# EasyEDA schematic SCH_OpenIDS2.json
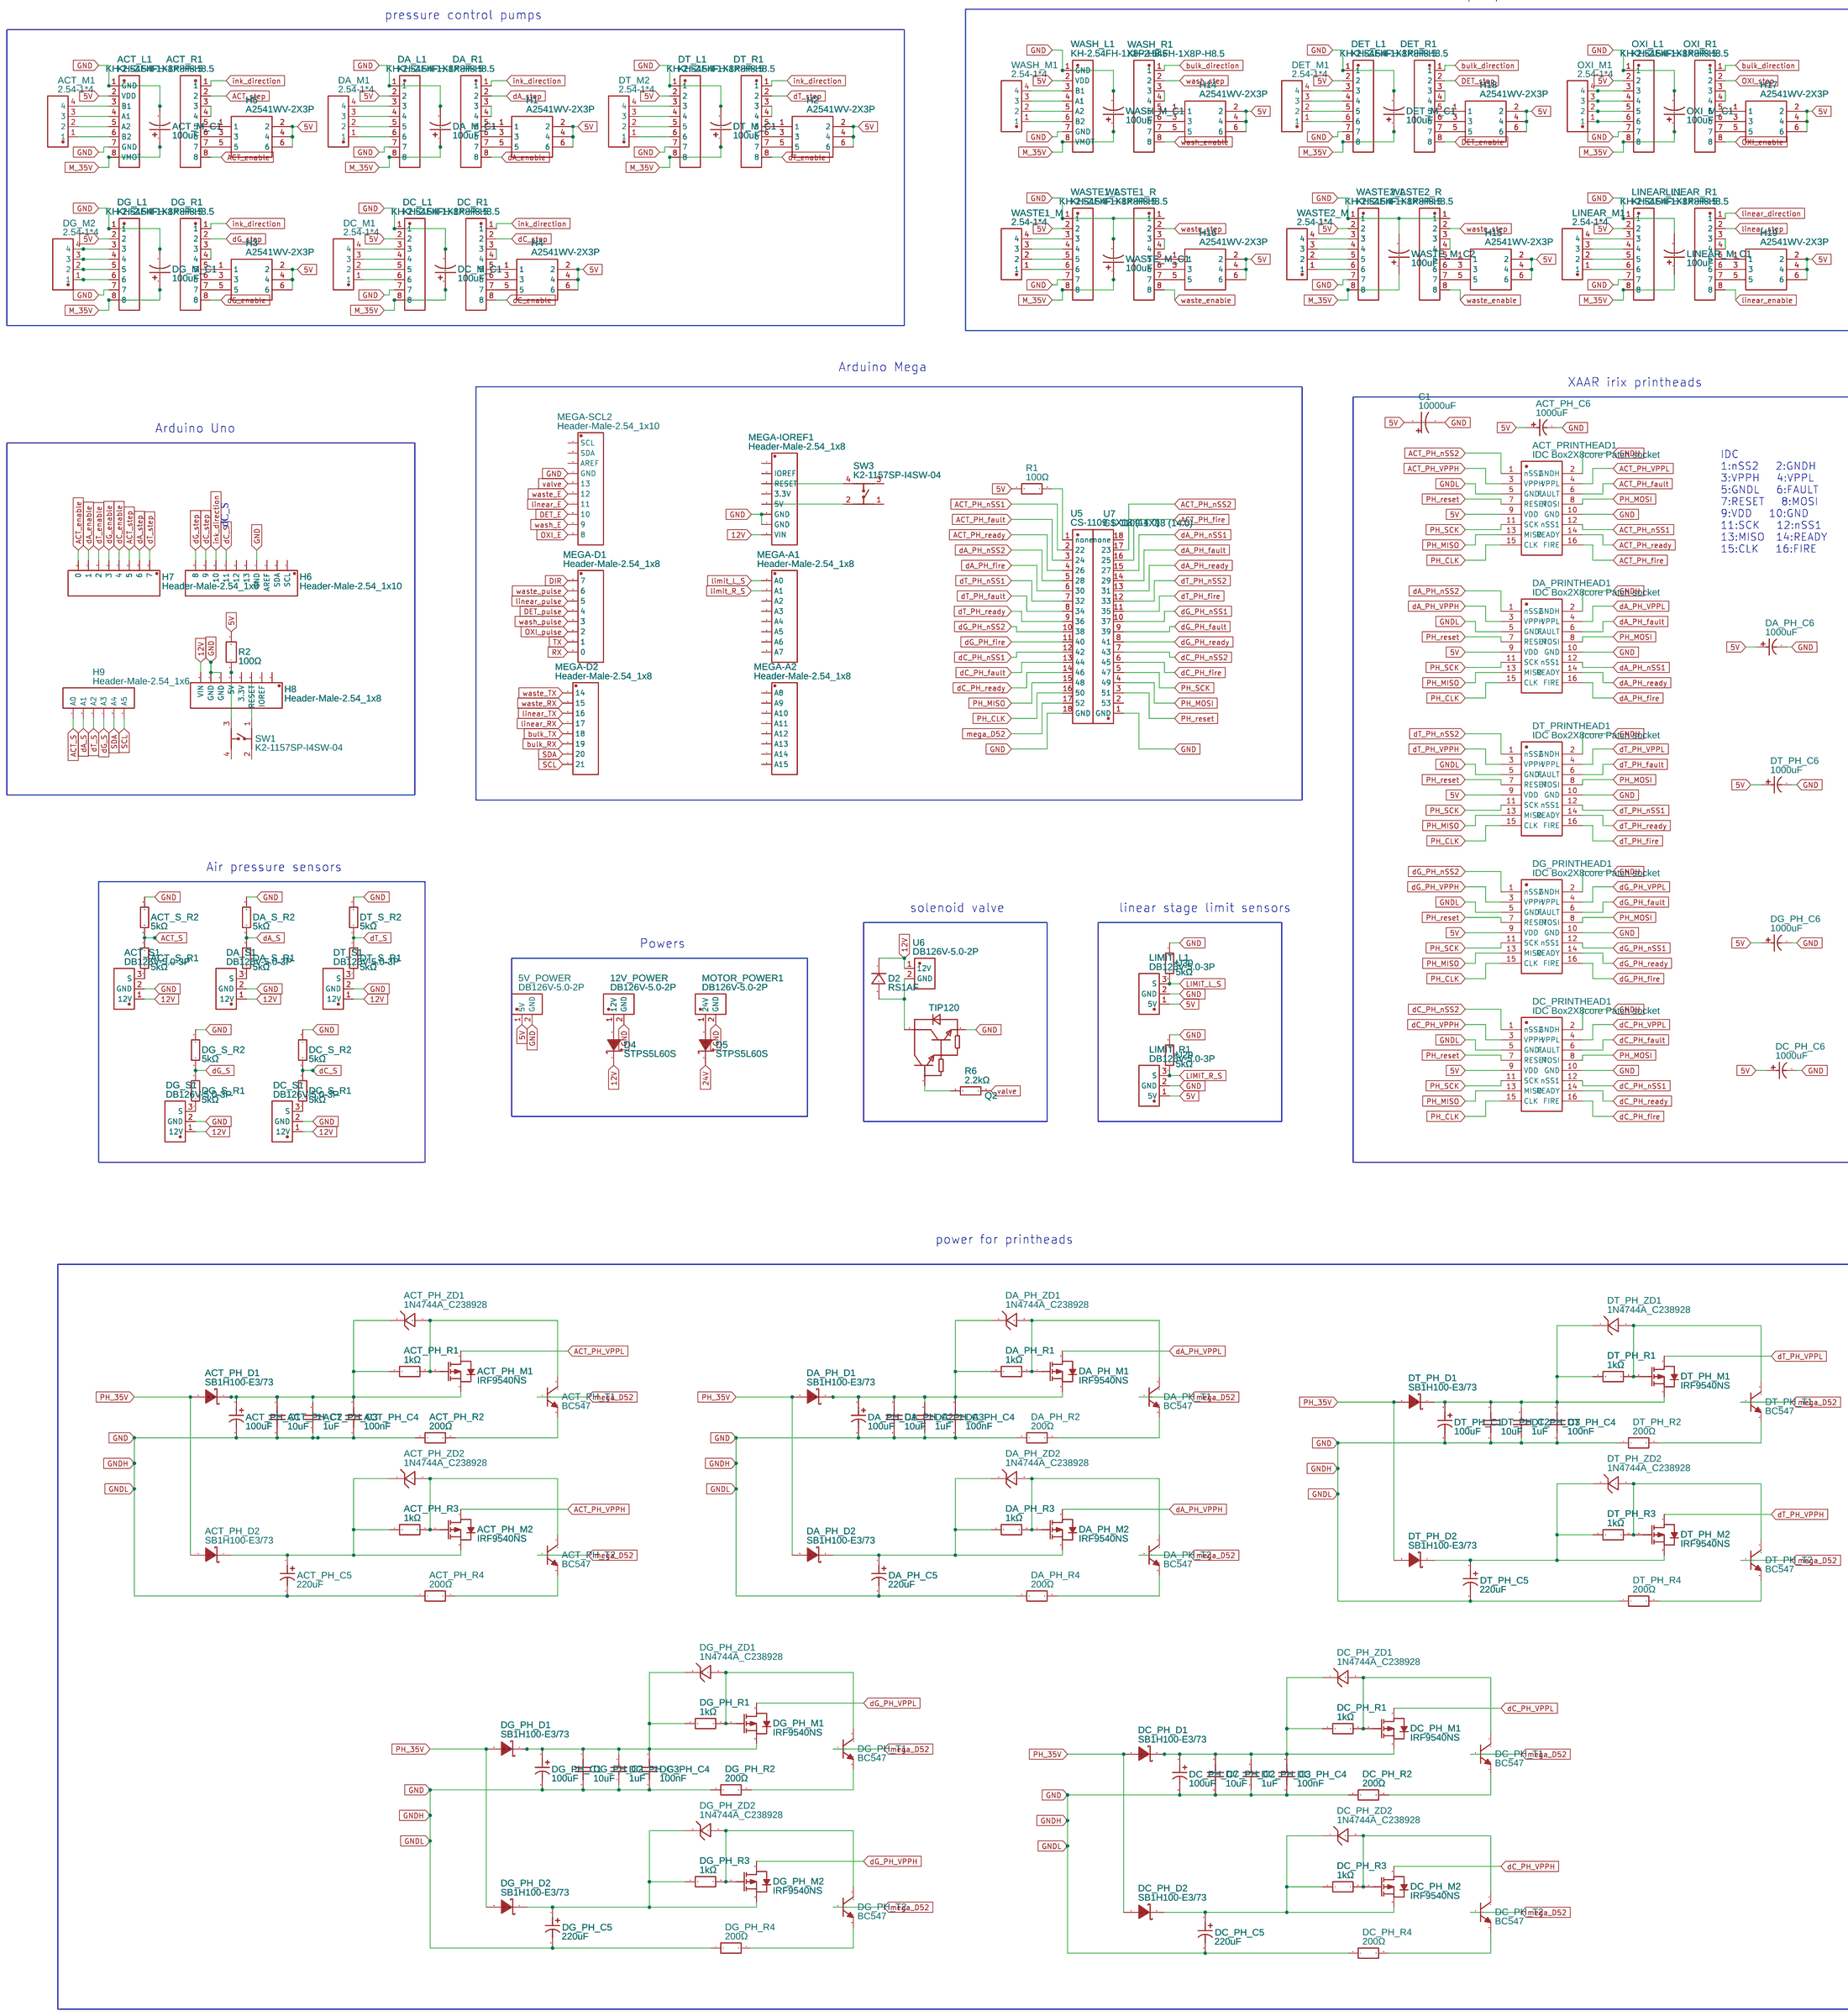
[diagram p0: schematic sheet]

## Parts
5V_POWER  DB126V-5.0-2P  [CONN-TH_2P-P5.00_L7.8-W10.0]
12V_POWER  DB126V-5.0-2P  [CONN-TH_2P-P5.00_L7.8-W10.0]
ACT_L1  KH-2.54FH-1X8P-H8.5  [HDR-TH_8P-P2.54-V-F]
ACT_M1  2.54-1*4  [HDR-TH_4P-P2.54-V-M-1]
ACT_M_C1  100uF  [CAP-TH_BD8.0-P3.50-D0.6-FD]
ACT_PH_C1  100uF  [CAP-TH_BD10.0-P5.00-D0.6-FD]
ACT_PH_C2  10uF  [C1210]
ACT_PH_C3  1uF  [C1210]
ACT_PH_C4  100nF  [C0402]
ACT_PH_C5  220uF  [CAP-SMD_BD10.0-L10.3-W10.3-LS11.3-FD]
ACT_PH_C6  1000uF  [CAP-TH_BD8.0-P3.50-D0.6-FD]
ACT_PH_D1  SB1H100-E3/73  [DO-41_BD2.4-L4.7-P8.70-D0.9-RD]
ACT_PH_D2  SB1H100-E3/73  [DO-41_BD2.4-L4.7-P8.70-D0.9-RD]
ACT_PH_M1  IRF9540NS  [TO-263-2_L10.2-W8.7-P5.08-LS15.1-BL]
ACT_PH_M2  IRF9540NS  [TO-263-2_L10.2-W8.7-P5.08-LS15.1-BL]
ACT_PH_R1  1kΩ  [R2512]
ACT_PH_R2  200Ω  [RES-TH_BD2.7-L6.2-P10.20-D0.4]
ACT_PH_R3  1kΩ  [R2512]
ACT_PH_R4  200Ω  [RES-TH_BD2.7-L6.2-P10.20-D0.4]
ACT_PH_T1  BC547  [TO-92-3_L4.5-W3.5-P1.27-L]
ACT_PH_T2  BC547  [TO-92-3_L4.5-W3.5-P1.27-L]
ACT_PH_ZD1  1N4744A_C238928  [DO-41_BD2.4-L4.7-P8.70-D0.9-RD]
ACT_PH_ZD2  1N4744A_C238928  [DO-41_BD2.4-L4.7-P8.70-D0.9-RD]
ACT_PRINTHEAD1  IDC Box2X8core Patch socket  [IDC-SMD_16P-P2.00-2X8P-2.0MM-N]
ACT_R1  KH-2.54FH-1X8P-H8.5  [HDR-TH_8P-P2.54-V-F]
ACT_S1  DB126V-5.0-3P  [CONN-TH_3P-P5.00_DB126V-5.0-3P]
ACT_S_R1  5kΩ  [R0603]
ACT_S_R2  5kΩ  [R0603]
C1  10000uF  [CAP-TH_BD16.0-P7.50-D1.2-FD]
D2  RS1AF  [SMAF_L3.5-W2.6-LS4.7-RD]
D4  STPS5L60S  [SMC_L6.9-W5.9-LS7.9-RD]
D5  STPS5L60S  [SMC_L6.9-W5.9-LS7.9-RD]
DA_L1  KH-2.54FH-1X8P-H8.5  [HDR-TH_8P-P2.54-V-F]
DA_M1  2.54-1*4  [HDR-TH_4P-P2.54-V-M-1]
DA_M_C1  100uF  [CAP-TH_BD8.0-P3.50-D0.6-FD]
DA_PH_C1  100uF  [CAP-TH_BD10.0-P5.00-D0.6-FD]
DA_PH_C2  10uF  [C1210]
DA_PH_C3  1uF  [C1210]
DA_PH_C4  100nF  [C0402]
DA_PH_C5  220uF  [CAP-SMD_BD10.0-L10.3-W10.3-LS11.3-FD]
DA_PH_C6  1000uF  [CAP-TH_BD8.0-P3.50-D0.6-FD]
DA_PH_D1  SB1H100-E3/73  [DO-41_BD2.4-L4.7-P8.70-D0.9-RD]
DA_PH_D2  SB1H100-E3/73  [DO-41_BD2.4-L4.7-P8.70-D0.9-RD]
DA_PH_M1  IRF9540NS  [TO-263-2_L10.2-W8.7-P5.08-LS15.1-BL]
DA_PH_M2  IRF9540NS  [TO-263-2_L10.2-W8.7-P5.08-LS15.1-BL]
DA_PH_R1  1kΩ  [R2512]
DA_PH_R2  200Ω  [RES-TH_BD2.7-L6.2-P10.20-D0.4]
DA_PH_R3  1kΩ  [R2512]
DA_PH_R4  200Ω  [RES-TH_BD2.7-L6.2-P10.20-D0.4]
DA_PH_T1  BC547  [TO-92-3_L4.5-W3.5-P1.27-L]
DA_PH_T2  BC547  [TO-92-3_L4.5-W3.5-P1.27-L]
DA_PH_ZD1  1N4744A_C238928  [DO-41_BD2.4-L4.7-P8.70-D0.9-RD]
DA_PH_ZD2  1N4744A_C238928  [DO-41_BD2.4-L4.7-P8.70-D0.9-RD]
DA_PRINTHEAD1  IDC Box2X8core Patch socket  [IDC-SMD_16P-P2.00-2X8P-2.0MM-N]
DA_R1  KH-2.54FH-1X8P-H8.5  [HDR-TH_8P-P2.54-V-F]
DA_S1  DB126V-5.0-3P  [CONN-TH_3P-P5.00_DB126V-5.0-3P]
DA_S_R1  5kΩ  [R0603]
DA_S_R2  5kΩ  [R0603]
DC_L1  KH-2.54FH-1X8P-H8.5  [HDR-TH_8P-P2.54-V-F]
DC_M1  2.54-1*4  [HDR-TH_4P-P2.54-V-M-1]
DC_M_C1  100uF  [CAP-TH_BD8.0-P3.50-D0.6-FD]
DC_PH_C2  10uF  [C1210]
DC_PH_C3  1uF  [C1210]
DC_PH_C4  100nF  [C0402]
DC_PH_C5  220uF  [CAP-SMD_BD10.0-L10.3-W10.3-LS11.3-FD]
DC_PH_C6  1000uF  [CAP-TH_BD8.0-P3.50-D0.6-FD]
DC_PH_C7  100uF  [CAP-TH_BD10.0-P5.00-D0.6-FD]
DC_PH_D1  SB1H100-E3/73  [DO-41_BD2.4-L4.7-P8.70-D0.9-RD]
DC_PH_D2  SB1H100-E3/73  [DO-41_BD2.4-L4.7-P8.70-D0.9-RD]
DC_PH_M1  IRF9540NS  [TO-263-2_L10.2-W8.7-P5.08-LS15.1-BL]
DC_PH_M2  IRF9540NS  [TO-263-2_L10.2-W8.7-P5.08-LS15.1-BL]
DC_PH_R1  1kΩ  [R2512]
DC_PH_R2  200Ω  [RES-TH_BD2.7-L6.2-P10.20-D0.4]
DC_PH_R3  1kΩ  [R2512]
DC_PH_R4  200Ω  [RES-TH_BD2.7-L6.2-P10.20-D0.4]
DC_PH_T1  BC547  [TO-92-3_L4.5-W3.5-P1.27-L]
DC_PH_T2  BC547  [TO-92-3_L4.5-W3.5-P1.27-L]
DC_PH_ZD1  1N4744A_C238928  [DO-41_BD2.4-L4.7-P8.70-D0.9-RD]
DC_PH_ZD2  1N4744A_C238928  [DO-41_BD2.4-L4.7-P8.70-D0.9-RD]
DC_PRINTHEAD1  IDC Box2X8core Patch socket  [IDC-SMD_16P-P2.00-2X8P-2.0MM-N]
DC_R1  KH-2.54FH-1X8P-H8.5  [HDR-TH_8P-P2.54-V-F]
DC_S1  DB126V-5.0-3P  [CONN-TH_3P-P5.00_DB126V-5.0-3P]
DC_S_R1  5kΩ  [R0603]
DC_S_R2  5kΩ  [R0603]
DET_L1  KH-2.54FH-1X8P-H8.5  [HDR-TH_8P-P2.54-V-F]
DET_M1  2.54-1*4  [HDR-TH_4P-P2.54-V-M-1]
DET_M_C1  100uF  [CAP-TH_BD8.0-P3.50-D0.6-FD]
DET_R1  KH-2.54FH-1X8P-H8.5  [HDR-TH_8P-P2.54-V-F]
DG_L1  KH-2.54FH-1X8P-H8.5  [HDR-TH_8P-P2.54-V-F]
DG_M2  2.54-1*4  [HDR-TH_4P-P2.54-V-M-1]
DG_M_C1  100uF  [CAP-TH_BD8.0-P3.50-D0.6-FD]
DG_PH_C1  100uF  [CAP-TH_BD10.0-P5.00-D0.6-FD]
DG_PH_C2  10uF  [C1210]
DG_PH_C3  1uF  [C1210]
DG_PH_C4  100nF  [C0402]
DG_PH_C5  220uF  [CAP-SMD_BD10.0-L10.3-W10.3-LS11.3-FD]
DG_PH_C6  1000uF  [CAP-TH_BD8.0-P3.50-D0.6-FD]
DG_PH_D1  SB1H100-E3/73  [DO-41_BD2.4-L4.7-P8.70-D0.9-RD]
DG_PH_D2  SB1H100-E3/73  [DO-41_BD2.4-L4.7-P8.70-D0.9-RD]
DG_PH_M1  IRF9540NS  [TO-263-2_L10.2-W8.7-P5.08-LS15.1-BL]
DG_PH_M2  IRF9540NS  [TO-263-2_L10.2-W8.7-P5.08-LS15.1-BL]
DG_PH_R1  1kΩ  [R2512]
DG_PH_R2  200Ω  [RES-TH_BD2.7-L6.2-P10.20-D0.4]
DG_PH_R3  1kΩ  [R2512]
DG_PH_R4  200Ω  [RES-TH_BD2.7-L6.2-P10.20-D0.4]
DG_PH_T1  BC547  [TO-92-3_L4.5-W3.5-P1.27-L]
DG_PH_T2  BC547  [TO-92-3_L4.5-W3.5-P1.27-L]
DG_PH_ZD1  1N4744A_C238928  [DO-41_BD2.4-L4.7-P8.70-D0.9-RD]
DG_PH_ZD2  1N4744A_C238928  [DO-41_BD2.4-L4.7-P8.70-D0.9-RD]
DG_PRINTHEAD1  IDC Box2X8core Patch socket  [IDC-SMD_16P-P2.00-2X8P-2.0MM-N]
DG_R1  KH-2.54FH-1X8P-H8.5  [HDR-TH_8P-P2.54-V-F]
DG_S1  DB126V-5.0-3P  [CONN-TH_3P-P5.00_DB126V-5.0-3P]
DG_S_R1  5kΩ  [R0603]
DG_S_R2  5kΩ  [R0603]
DT_L1  KH-2.54FH-1X8P-H8.5  [HDR-TH_8P-P2.54-V-F]
DT_M2  2.54-1*4  [HDR-TH_4P-P2.54-V-M-1]
DT_M_C1  100uF  [CAP-TH_BD8.0-P3.50-D0.6-FD]
DT_PH_C1  100uF  [CAP-TH_BD10.0-P5.00-D0.6-FD]
DT_PH_C2  10uF  [C1210]
DT_PH_C3  1uF  [C1210]
DT_PH_C4  100nF  [C0402]
DT_PH_C5  220uF  [CAP-SMD_BD10.0-L10.3-W10.3-LS11.3-FD]
DT_PH_C6  1000uF  [CAP-TH_BD8.0-P3.50-D0.6-FD]
DT_PH_D1  SB1H100-E3/73  [DO-41_BD2.4-L4.7-P8.70-D0.9-RD]
DT_PH_D2  SB1H100-E3/73  [DO-41_BD2.4-L4.7-P8.70-D0.9-RD]
DT_PH_M1  IRF9540NS  [TO-263-2_L10.2-W8.7-P5.08-LS15.1-BL]
DT_PH_M2  IRF9540NS  [TO-263-2_L10.2-W8.7-P5.08-LS15.1-BL]
DT_PH_R1  1kΩ  [R2512]
DT_PH_R2  200Ω  [RES-TH_BD2.7-L6.2-P10.20-D0.4]
DT_PH_R3  1kΩ  [R2512]
DT_PH_R4  200Ω  [RES-TH_BD2.7-L6.2-P10.20-D0.4]
DT_PH_T1  BC547  [TO-92-3_L4.5-W3.5-P1.27-L]
DT_PH_T2  BC547  [TO-92-3_L4.5-W3.5-P1.27-L]
DT_PH_ZD1  1N4744A_C238928  [DO-41_BD2.4-L4.7-P8.70-D0.9-RD]
DT_PH_ZD2  1N4744A_C238928  [DO-41_BD2.4-L4.7-P8.70-D0.9-RD]
DT_PRINTHEAD1  IDC Box2X8core Patch socket  [IDC-SMD_16P-P2.00-2X8P-2.0MM-N]
DT_R1  KH-2.54FH-1X8P-H8.5  [HDR-TH_8P-P2.54-V-F]
DT_S1  DB126V-5.0-3P  [CONN-TH_3P-P5.00_DB126V-5.0-3P]
DT_S_R1  5kΩ  [R0603]
DT_S_R2  5kΩ  [R0603]
H1  A2541WV-2X3P  [HDR-TH_6P-P2.54-V-R2-C3-S2.54_A2541WV-2X3P]
H2  A2541WV-2X3P  [HDR-TH_6P-P2.54-V-R2-C3-S2.54_A2541WV-2X3P]
H3  A2541WV-2X3P  [HDR-TH_6P-P2.54-V-R2-C3-S2.54_A2541WV-2X3P]
H4  A2541WV-2X3P  [HDR-TH_6P-P2.54-V-R2-C3-S2.54_A2541WV-2X3P]
H5  A2541WV-2X3P  [HDR-TH_6P-P2.54-V-R2-C3-S2.54_A2541WV-2X3P]
H6  Header-Male-2.54_1x10  [HDR-TH_10P-P2.54-V-M-1]
H7  Header-Male-2.54_1x8  [HDR-TH_8P-P2.54-V-M]
H8  Header-Male-2.54_1x8  [HDR-TH_8P-P2.54-V-M]
H9  Header-Male-2.54_1x6  [HDR-TH_6P-P2.54-V-M-1]
H14  A2541WV-2X3P  [HDR-TH_6P-P2.54-V-R2-C3-S2.54_A2541WV-2X3P]
H15  A2541WV-2X3P  [HDR-TH_6P-P2.54-V-R2-C3-S2.54_A2541WV-2X3P]
H16  A2541WV-2X3P  [HDR-TH_6P-P2.54-V-R2-C3-S2.54_A2541WV-2X3P]
H17  A2541WV-2X3P  [HDR-TH_6P-P2.54-V-R2-C3-S2.54_A2541WV-2X3P]
H18  A2541WV-2X3P  [HDR-TH_6P-P2.54-V-R2-C3-S2.54_A2541WV-2X3P]
H19  A2541WV-2X3P  [HDR-TH_6P-P2.54-V-R2-C3-S2.54_A2541WV-2X3P]
LIMIT_L1  DB126V-5.0-3P  [CONN-TH_3P-P5.00_DB126V-5.0-3P]
LIMIT_R1  DB126V-5.0-3P  [CONN-TH_3P-P5.00_DB126V-5.0-3P]
LINEAR_L1  KH-2.54FH-1X8P-H8.5  [HDR-TH_8P-P2.54-V-F]
LINEAR_M1  2.54-1*4  [HDR-TH_4P-P2.54-V-M-1]
LINEAR_M_C1  100uF  [CAP-TH_BD8.0-P3.50-D0.6-FD]
LINEAR_R1  KH-2.54FH-1X8P-H8.5  [HDR-TH_8P-P2.54-V-F]
MEGA-A1  Header-Male-2.54_1x8  [HDR-TH_8P-P2.54-V-M]
MEGA-A2  Header-Male-2.54_1x8  [HDR-TH_8P-P2.54-V-M]
MEGA-D1  Header-Male-2.54_1x8  [HDR-TH_8P-P2.54-V-M]
MEGA-D2  Header-Male-2.54_1x8  [HDR-TH_8P-P2.54-V-M]
MEGA-IOREF1  Header-Male-2.54_1x8  [HDR-TH_8P-P2.54-V-M]
MEGA-SCL2  Header-Male-2.54_1x10  [HDR-TH_10P-P2.54-V-M-1]
MOTOR_POWER1  DB126V-5.0-2P  [CONN-TH_2P-P5.00_L7.8-W10.0]
OXI_L1  KH-2.54FH-1X8P-H8.5  [HDR-TH_8P-P2.54-V-F]
OXI_M1  2.54-1*4  [HDR-TH_4P-P2.54-V-M-1]
OXI_M_C1  100uF  [CAP-TH_BD8.0-P3.50-D0.6-FD]
OXI_R1  KH-2.54FH-1X8P-H8.5  [HDR-TH_8P-P2.54-V-F]
Q2  TIP120  [TO-220-3_L10.0-W4.5-P2.54-L]
R1  100Ω  [R0207]
R2  100Ω  [R0207]
R6  2.2kΩ  [R0805]
SW1  K2-1157SP-I4SW-04  [SW-SMD_4P-L6.2-W6.2-P4.50-LS8.6]
SW3  K2-1157SP-I4SW-04  [SW-SMD_4P-L6.2-W6.2-P4.50-LS8.6]
U5  CS-1109-1X18 (14.0)  [HDR-TH_18P-P2.54-V-M]
U6  DB126V-5.0-2P  [CONN-TH_2P-P5.00_L7.8-W10.0]
U7  CS-1109-1X18 (14.0)  [HDR-TH_18P-P2.54-V-M]
U29  5kΩ  [R0603]
U30  5kΩ  [R0603]
WASH_L1  KH-2.54FH-1X8P-H8.5  [HDR-TH_8P-P2.54-V-F]
WASH_M1  2.54-1*4  [HDR-TH_4P-P2.54-V-M-1]
WASH_M_C1  100uF  [CAP-TH_BD8.0-P3.50-D0.6-FD]
WASH_R1  KH-2.54FH-1X8P-H8.5  [HDR-TH_8P-P2.54-V-F]
WASTE1_L  KH-2.54FH-1X8P-H8.5  [HDR-TH_8P-P2.54-V-F]
WASTE1_M  2.54-1*4  [HDR-TH_4P-P2.54-V-M-1]
WASTE1_R  KH-2.54FH-1X8P-H8.5  [HDR-TH_8P-P2.54-V-F]
WASTE2_L  KH-2.54FH-1X8P-H8.5  [HDR-TH_8P-P2.54-V-F]
WASTE2_M  2.54-1*4  [HDR-TH_4P-P2.54-V-M-1]
WASTE2_R  KH-2.54FH-1X8P-H8.5  [HDR-TH_8P-P2.54-V-F]
WASTE_M_C1  100uF  [CAP-TH_BD8.0-P3.50-D0.6-FD]
WASTE_M_C2  100uF  [CAP-TH_BD8.0-P3.50-D0.6-FD]

## Library data of the parts
5V_POWER 12V_POWER MOTOR_POWER1 U6 = DB126V-5.0-2P: Contributor: LCSC; Supplier: LCSC; Supplier Part: C395849; Manufacturer: DORABO(地博电气); Manufacturer Part: DB126V-5.0-2P-GN-P; JLCPCB Part Class: Extended Part
ACT_L1 ACT_R1 DA_L1 DA_R1 DC_L1 DC_R1 DET_L1 DET_R1 DG_L1 DG_R1 DT_L1 DT_R1 LINEAR_L1 LINEAR_R1 OXI_L1 OXI_R1 WASH_L1 WASH_R1 WASTE1_L WASTE1_R WASTE2_L WASTE2_R = KH-2.54FH-1X8P-H8.5: Contributor: LCSC; Supplier: LCSC; Supplier Part: C2905417; Manufacturer: kinghelm(金航标); JLCPCB Part Class: Extended Part
ACT_M1 DA_M1 DC_M1 DET_M1 DG_M2 DT_M2 LINEAR_M1 OXI_M1 WASH_M1 WASTE1_M WASTE2_M = 2.54-1*4: Supplier: LCSC; Supplier Part: C5116483; Manufacturer: ZHOURI(洲日); JLCPCB Part Class: Extended Part; Contributor: lcsc
ACT_M_C1 DA_M_C1 DC_M_C1 DET_M_C1 DG_M_C1 DT_M_C1 LINEAR_M_C1 OXI_M_C1 WASH_M_C1 WASTE_M_C1 WASTE_M_C2 = 50YXF100MEFCCE8X11.5: Contributor: lcsc; Supplier: LCSC; Supplier Part: C2940705; Manufacturer: rubycon(红宝石)
ACT_PH_C1 DA_PH_C1 DC_PH_C7 DG_PH_C1 DT_PH_C1 = 1011001013R00: Contributor: LCSC; Supplier: LCSC; Supplier Part: C2887236; Manufacturer: NJCON(永立); JLCPCB Part Class: Extended Part
ACT_PH_C2 DA_PH_C2 DC_PH_C2 DG_PH_C2 DT_PH_C2 = C1210X106K050T: Contributor: LCSC; Supplier: LCSC; Manufacturer: IHHEC(禾伸堂); Supplier Part: C172721; JLCPCB Part Class: Extended Part
ACT_PH_C3 DA_PH_C3 DC_PH_C3 DG_PH_C3 DT_PH_C3 = 1210B105K101NT: Supplier: LCSC; Manufacturer: FH(风华); Supplier Part: C24365; JLCPCB Part Class: Extended Part
ACT_PH_C4 DA_PH_C4 DC_PH_C4 DG_PH_C4 DT_PH_C4 = C1005X7R1H104KT000S: Contributor: LCSC; Supplier: LCSC; Supplier Part: C432917; Manufacturer: TDK; JLCPCB Part Class: Extended Part
ACT_PH_C5 DA_PH_C5 DC_PH_C5 DG_PH_C5 DT_PH_C5 = RVT1H221M1010 220UF 50V: Supplier: LCSC; Supplier Part: C970698; Manufacturer: DMBJ(振宝佳); JLCPCB Part Class: Extended Part; Contributor: lcsc
ACT_PH_C6 DA_PH_C6 DC_PH_C6 DG_PH_C6 DT_PH_C6 = KF102M010F140A: Supplier: LCSC; Manufacturer: CapXon(丰宾); Supplier Part: C59324; JLCPCB Part Class: Extended Part
ACT_PH_D1 ACT_PH_D2 DA_PH_D1 DA_PH_D2 DC_PH_D1 DC_PH_D2 DG_PH_D1 DG_PH_D2 DT_PH_D1 DT_PH_D2 = SB1H100-E3/73: Contributor: LCSC; Supplier: LCSC; Manufacturer: VISHAY(威世); Supplier Part: C145309; JLCPCB Part Class: Extended Part
ACT_PH_M1 ACT_PH_M2 DA_PH_M1 DA_PH_M2 DC_PH_M1 DC_PH_M2 DG_PH_M1 DG_PH_M2 DT_PH_M1 DT_PH_M2 = IRF9540NS: Supplier: LCSC; Supplier Part: C19272230; Manufacturer: minos(迈诺斯); Contributor: lcsc
ACT_PH_R1 ACT_PH_R3 DA_PH_R1 DA_PH_R3 DC_PH_R1 DC_PH_R3 DG_PH_R1 DG_PH_R3 DT_PH_R1 DT_PH_R3 = HOCR2512-2W-1KR-5%: Supplier: LCSC; Supplier Part: C5123626; Manufacturer: Milliohm(毫欧); Manufacturer Part: HoCR2512-2W-1KR-5%; JLCPCB Part Class: Extended Part; Contributor: lcsc
ACT_PH_R2 ACT_PH_R4 DA_PH_R2 DA_PH_R4 DC_PH_R2 DC_PH_R4 DG_PH_R2 DG_PH_R4 DT_PH_R2 DT_PH_R4 = CR1/4W-200Ω±5%-ST52: Contributor: lcsc; Supplier: LCSC; Supplier Part: C2894669; Manufacturer: VO(翔胜); JLCPCB Part Class: Extended Part
ACT_PH_T1 ACT_PH_T2 DA_PH_T1 DA_PH_T2 DC_PH_T1 DC_PH_T2 DG_PH_T1 DG_PH_T2 DT_PH_T1 DT_PH_T2 = BC547: Contributor: LCSC; Supplier: LCSC; Supplier Part: C2910381; Manufacturer: CJ(江苏长电/长晶); Manufacturer Part: BC547(RANGE:420-800); JLCPCB Part Class: Extended Part
ACT_PH_ZD1 ACT_PH_ZD2 DA_PH_ZD1 DA_PH_ZD2 DC_PH_ZD1 DC_PH_ZD2 DG_PH_ZD1 DG_PH_ZD2 DT_PH_ZD1 DT_PH_ZD2 = 1N4744A_C238928: Contributor: LCSC; Supplier: LCSC; Supplier Part: C238928; Manufacturer: onsemi(安森美); Manufacturer Part: 1N4744A; JLCPCB Part Class: Extended Part
ACT_PRINTHEAD1 DA_PRINTHEAD1 DC_PRINTHEAD1 DG_PRINTHEAD1 DT_PRINTHEAD1 = IDC Box2X8core Patch socket: Contributor: LCSC; Supplier: LCSC; Manufacturer: BOOMELE(博穆精密); Manufacturer Part: 2.0-2*8P立贴简牛; Supplier Part: C59601; JLCPCB Part Class: Extended Part
ACT_S1 DA_S1 DC_S1 DG_S1 DT_S1 LIMIT_L1 LIMIT_R1 = DB126V-5.0-3P: Contributor: LCSC; Supplier: LCSC; Supplier Part: C395850; Manufacturer: DORABO(地博电气); Manufacturer Part: DB126V-5.0-3P-GN; JLCPCB Part Class: Extended Part
ACT_S_R1 ACT_S_R2 DA_S_R1 DA_S_R2 DC_S_R1 DC_S_R2 DG_S_R1 DG_S_R2 DT_S_R1 DT_S_R2 = RT0603BRE075KL: Contributor: lcsc; Supplier: LCSC; Supplier Part: C862232; Manufacturer: YAGEO(国巨); JLCPCB Part Class: Extended Part
C1 = KM1C103ML350A00CV0: Contributor: LCSC; Supplier: LCSC; Supplier Part: C240406; Manufacturer: HUAWEI(华威集团); JLCPCB Part Class: Extended Part
D2 = RS1AF: Contributor: LCSC; Supplier: LCSC; Supplier Part: C183409; Manufacturer: SHIKUES(时科); JLCPCB Part Class: Extended Part
D4 D5 = STPS5L60S: Contributor: LCSC; Supplier Part: C140620; Supplier: LCSC; Manufacturer: ST(意法半导体); JLCPCB Part Class: Extended Part
H1-H5 H14-H19 = A2541WV-2X3P: Contributor: LCSC; Supplier: LCSC; Supplier Part: C225518; Manufacturer: CJT(长江连接器); Manufacturer Part: A2541WV-2x3P; JLCPCB Part Class: Extended Part
H6 MEGA-SCL2 = Header-Male-2.54_1x10: Supplier: LCSC; Manufacturer Part: 2.54-1*10P针; Supplier Part: C57369; JLCPCB Part Class: Extended Part; Manufacturer: BOOMELE(博穆精密)
H7 H8 MEGA-A1 MEGA-A2 MEGA-D1 MEGA-D2 MEGA-IOREF1 = Header-Male-2.54_1x8: Contributor: LCSC; Supplier: LCSC; Manufacturer: Ckmtw(灿科盟); Manufacturer Part: B-2100S08P-A110; Supplier Part: C124381; JLCPCB Part Class: Extended Part
H9 = Header-Male-2.54_1x6: Supplier: LCSC; Manufacturer: BOOMELE(博穆精密); Manufacturer Part: 2.54-1x6P直针; Supplier Part: C37208; JLCPCB Part Class: Extended Part
Q2 = TIP120: Contributor: LCSC; Supplier: LCSC; Supplier Part: C262990; Manufacturer: ST(意法半导体); JLCPCB Part Class: Extended Part
R1 R2 = CMB02070X1000GB200: Supplier: LCSC; Supplier Part: C4331969; Manufacturer: VISHAY(威世); JLCPCB Part Class: Extended Part; Contributor: lcsc
R6 = RMC08052.2K1%N: Contributor: LCSC; Supplier: LCSC; Supplier Part: C325769; Manufacturer: Tyohm(幸亚电阻); JLCPCB Part Class: Extended Part
SW1 SW3 = K2-1157SP-I4SW-04: Contributor: LCSC; Supplier: LCSC; Supplier Part: C2909692; Manufacturer: 韩国韩荣; Manufacturer Part: K2-1157SP-I4SW-01; JLCPCB Part Class: Extended Part
U5 U7 = CS-1109-1X18 (14.0): Contributor: lcsc; Supplier: LCSC; Supplier Part: C5142873; Manufacturer: CST(永丰盈); JLCPCB Part Class: Extended Part
U29 U30 = TR0603B5K00P0525Z: Contributor: lcsc; Supplier: LCSC; Supplier Part: C3202451; Manufacturer: EVER OHMS(天二科技); JLCPCB Part Class: Extended Part

## Nets
5V: 5V_POWER.1(5V) ACT_L1.2(VDD) ACT_PH_C6.1 ACT_PRINTHEAD1.9(VDD) C1.1 DA_L1.2 DA_PH_C6.1 DA_PRINTHEAD1.9(VDD) DC_L1.2 DC_PH_C6.1 DC_PRINTHEAD1.9(VDD) DET_L1.2 DG_L1.2 DG_PH_C6.1 DG_PRINTHEAD1.9(VDD) DT_L1.2 DT_PH_C6.1 DT_PRINTHEAD1.9(VDD) H1.2 H1.4 H1.6 H2.2 H2.4 H2.6 H3.2 H3.4 H3.6 H4.2 H4.4 H4.6 H5.2 H5.4 H5.6 H14.2 H14.4 H14.6 H15.2 H15.4 H15.6 H16.2 H16.4 H16.6 H17.2 H17.4 H17.6 H18.2 H18.4 H18.6 H19.2 H19.4 H19.6 LIMIT_L1.1(5V) LIMIT_R1.1(5V) LINEAR_L1.2 OXI_L1.2 R1.1 R2.2 WASH_L1.2(VDD) WASTE1_L.2 WASTE2_L.2
12V: ACT_S1.1(12V) D2.1 D4.1(C) DA_S1.1(12V) DC_S1.1(12V) DG_S1.1(12V) DT_S1.1(12V) H8.8(VIN) MEGA-IOREF1.8(VIN) U6.1(12V)
24V: D5.1(C)
GND: 5V_POWER.2(GND) 12V_POWER.2(GND) ACT_L1.1(GND) ACT_L1.7(GND) ACT_M_C1.2 ACT_PH_C1.2 ACT_PH_C2.2 ACT_PH_C3.1 ACT_PH_C4.1 ACT_PH_C5.2 ACT_PH_C6.2 ACT_PH_R2.1 ACT_PH_R4.1 ACT_PRINTHEAD1.2(GNDH) ACT_PRINTHEAD1.5(GNDL) ACT_PRINTHEAD1.10(GND) ACT_S1.2(GND) ACT_S_R2.2 C1.2 DA_L1.1 DA_L1.7 DA_M_C1.2 DA_PH_C1.2 DA_PH_C2.2 DA_PH_C3.1 DA_PH_C4.1 DA_PH_C5.2 DA_PH_C6.2 DA_PH_R2.1 DA_PH_R4.1 DA_PRINTHEAD1.2(GNDH) DA_PRINTHEAD1.5(GNDL) DA_PRINTHEAD1.10(GND) DA_S1.2(GND) DA_S_R2.2 DC_L1.1 DC_L1.7 DC_M_C1.2 DC_PH_C2.2 DC_PH_C3.1 DC_PH_C4.1 DC_PH_C5.2 DC_PH_C6.2 DC_PH_C7.2 DC_PH_R2.1 DC_PH_R4.1 DC_PRINTHEAD1.2(GNDH) DC_PRINTHEAD1.5(GNDL) DC_PRINTHEAD1.10(GND) DC_S1.2(GND) DC_S_R2.2 DET_L1.1 DET_L1.7 DET_M_C1.2 DG_L1.1 DG_L1.7 DG_M_C1.2 DG_PH_C1.2 DG_PH_C2.2 DG_PH_C3.1 DG_PH_C4.1 DG_PH_C5.2 DG_PH_C6.2 DG_PH_R2.1 DG_PH_R4.1 DG_PRINTHEAD1.2(GNDH) DG_PRINTHEAD1.5(GNDL) DG_PRINTHEAD1.10(GND) DG_S1.2(GND) DG_S_R2.2 DT_L1.1 DT_L1.7 DT_M_C1.2 DT_PH_C1.2 DT_PH_C2.2 DT_PH_C3.1 DT_PH_C4.1 DT_PH_C5.2 DT_PH_C6.2 DT_PH_R2.1 DT_PH_R4.1 DT_PRINTHEAD1.2(GNDH) DT_PRINTHEAD1.5(GNDL) DT_PRINTHEAD1.10(GND) DT_S1.2(GND) DT_S_R2.2 H6.4(GND) H8.6(GND) H8.7(GND) LIMIT_L1.2(GND) LIMIT_R1.2(GND) LINEAR_L1.1 LINEAR_L1.7 LINEAR_M_C1.2 MEGA-IOREF1.6(GND) MEGA-IOREF1.7(GND) MEGA-SCL2.4(GND) MOTOR_POWER1.2(GND) OXI_L1.1 OXI_L1.7 OXI_M_C1.2 Q2.3(E) U5.18(GND) U7.1(GND) U29.2 U30.1 WASH_L1.1(GND) WASH_L1.7(GND) WASH_M_C1.2 WASTE1_L.1 WASTE1_L.7 WASTE1_R.1 WASTE2_L.1 WASTE2_L.7 WASTE2_R.1 WASTE_M_C1.2 WASTE_M_C2.2
ACT_enable: ACT_R1.8 H7.8(0)
ACT_PH_fault: ACT_PRINTHEAD1.6(FAULT) U5.3(24)
ACT_PH_fire: ACT_PRINTHEAD1.16(FIRE) U7.16(25)
ACT_PH_nSS1: ACT_PRINTHEAD1.12(nSS1) U5.2(22)
ACT_PH_nSS2: ACT_PRINTHEAD1.1(nSS2) U7.17(23)
ACT_PH_ready: ACT_PRINTHEAD1.14(READY) U5.4(26)
ACT_PH_VPPH: ACT_PH_M2.2(D) ACT_PRINTHEAD1.3(VPPH)
ACT_PH_VPPL: ACT_PH_M1.2(D) ACT_PRINTHEAD1.4(VPPL)
ACT_S: ACT_S_R1.2 ACT_S_R2.1 H9.1(A0)
ACT_step: ACT_R1.2 H7.3(5)
bulk_direction: DET_R1.1 OXI_R1.1 WASH_R1.1
bulk_RX: MEGA-D2.6(19)
bulk_TX: MEGA-D2.5(18)
dA_enable: DA_R1.8 H7.7(1)
dA_PH_fault: DA_PRINTHEAD1.6(FAULT) U7.14(29)
dA_PH_fire: DA_PRINTHEAD1.16(FIRE) U5.6(30)
dA_PH_nSS1: DA_PRINTHEAD1.12(nSS1) U7.15(27)
dA_PH_nSS2: DA_PRINTHEAD1.1(nSS2) U5.5(28)
dA_PH_ready: DA_PRINTHEAD1.14(READY) U7.13(31)
dA_PH_VPPH: DA_PH_M2.2(D) DA_PRINTHEAD1.3(VPPH)
dA_PH_VPPL: DA_PH_M1.2(D) DA_PRINTHEAD1.4(VPPL)
dA_S: DA_S_R1.2 DA_S_R2.1 H9.2(A1)
dA_step: DA_R1.2 H7.2(6)
dC_enable: DC_R1.8 H7.4
dC_PH_fault: DC_PRINTHEAD1.6(FAULT) U5.13(44)
dC_PH_fire: DC_PRINTHEAD1.16(FIRE) U7.6(45)
dC_PH_nSS1: DC_PRINTHEAD1.12(nSS1) U5.12(42)
dC_PH_nSS2: DC_PRINTHEAD1.1(nSS2) U7.7(43)
dC_PH_ready: DC_PRINTHEAD1.14(READY) U5.14(46)
dC_PH_VPPH: DC_PH_M2.2(D) DC_PRINTHEAD1.3(VPPH)
dC_PH_VPPL: DC_PH_M1.2(D) DC_PRINTHEAD1.4(VPPL)
dC_S: DC_S_R1.2 DC_S_R2.1 H6.7(11)
dC_step: DC_R1.2 H6.9
DET_E: MEGA-SCL2.8(10)
DET_enable: DET_R1.8
DET_pulse: MEGA-D1.4
DET_step: DET_R1.2
dG_enable: DG_R1.8 H7.5(3)
dG_PH_fault: DG_PRINTHEAD1.6(FAULT) U7.9(39)
dG_PH_fire: DG_PRINTHEAD1.16(FIRE) U5.11(40)
dG_PH_nSS1: DG_PRINTHEAD1.12(nSS1) U7.10(37)
dG_PH_nSS2: DG_PRINTHEAD1.1(nSS2) U5.10(38)
dG_PH_ready: DG_PRINTHEAD1.14(READY) U7.8(41)
dG_PH_VPPH: DG_PH_M2.2(D) DG_PRINTHEAD1.3(VPPH)
dG_PH_VPPL: DG_PH_M1.2(D) DG_PRINTHEAD1.4(VPPL)
dG_S: DG_S_R1.2 DG_S_R2.1 H9.4(A3)
dG_step: DG_R1.2 H6.10(8)
DIR: MEGA-D1.1(7)
dT_enable: DT_R1.8 H7.6(2)
dT_PH_fault: DT_PRINTHEAD1.6(FAULT) U5.8(34)
dT_PH_fire: DT_PRINTHEAD1.16(FIRE) U7.11(35)
dT_PH_nSS1: DT_PRINTHEAD1.12(nSS1) U5.7(32)
dT_PH_nSS2: DT_PRINTHEAD1.1(nSS2) U7.12(33)
dT_PH_ready: DT_PRINTHEAD1.14(READY) U5.9(36)
dT_PH_VPPH: DT_PH_M2.2(D) DT_PRINTHEAD1.3(VPPH)
dT_PH_VPPL: DT_PH_M1.2(D) DT_PRINTHEAD1.4(VPPL)
dT_S: DT_S_R1.2 DT_S_R2.1 H9.3(A2)
dT_step: DT_R1.2 H7.1(7)
ink_direction: ACT_R1.1 DA_R1.1 DC_R1.1 DG_R1.1 DT_R1.1 H6.8(10)
LIMIT_L_S: LIMIT_L1.3(S) U30.2
limit_L_S: MEGA-A1.1(A0)
LIMIT_R_S: LIMIT_R1.3(S) U29.1
limit_R_S: MEGA-A1.2(A1)
linear_direction: LINEAR_R1.1
linear_E: MEGA-SCL2.7(11)
linear_enable: LINEAR_R1.8
linear_pulse: MEGA-D1.3(5)
linear_RX: MEGA-D2.4(17)
linear_step: LINEAR_R1.2
linear_TX: MEGA-D2.3(16)
M_35V: ACT_L1.8(VMOT) ACT_M_C1.1 DA_L1.8 DA_M_C1.1 DC_L1.8 DC_M_C1.1 DET_L1.8 DET_M_C1.1 DG_L1.8 DG_M_C1.1 DT_L1.8 DT_M_C1.1 LINEAR_L1.8 LINEAR_M_C1.1 OXI_L1.8 OXI_M_C1.1 WASH_L1.8(VMOT) WASH_M_C1.1 WASTE1_L.8 WASTE2_L.8 WASTE_M_C1.1 WASTE_M_C2.1
mega_D52: ACT_PH_T1.2(B) ACT_PH_T2.2(B) DA_PH_T1.2(B) DA_PH_T2.2(B) DC_PH_T1.2(B) DC_PH_T2.2(B) DG_PH_T1.2(B) DG_PH_T2.2(B) DT_PH_T1.2(B) DT_PH_T2.2(B) U5.17(52)
OXI_E: MEGA-SCL2.10(8)
OXI_enable: OXI_R1.8
OXI_pulse: MEGA-D1.6(2)
OXI_step: OXI_R1.2
PH_35V: ACT_PH_D1.2(A) ACT_PH_D2.2(A) DA_PH_D1.2(A) DA_PH_D2.2(A) DC_PH_D1.2(A) DC_PH_D2.2(A) DG_PH_D1.2(A) DG_PH_D2.2(A) DT_PH_D1.2(A) DT_PH_D2.2(A)
PH_CLK: ACT_PRINTHEAD1.15(CLK) DA_PRINTHEAD1.15(CLK) DC_PRINTHEAD1.15(CLK) DG_PRINTHEAD1.15(CLK) DT_PRINTHEAD1.15(CLK) U5.16(50)
PH_MISO: ACT_PRINTHEAD1.13(MISO) DA_PRINTHEAD1.13(MISO) DC_PRINTHEAD1.13(MISO) DG_PRINTHEAD1.13(MISO) DT_PRINTHEAD1.13(MISO) U5.15(48)
PH_MOSI: ACT_PRINTHEAD1.8(MOSI) DA_PRINTHEAD1.8(MOSI) DC_PRINTHEAD1.8(MOSI) DG_PRINTHEAD1.8(MOSI) DT_PRINTHEAD1.8(MOSI) U7.4(49)
PH_reset: ACT_PRINTHEAD1.7(RESET) DA_PRINTHEAD1.7(RESET) DC_PRINTHEAD1.7(RESET) DG_PRINTHEAD1.7(RESET) DT_PRINTHEAD1.7(RESET) U7.3(51)
PH_SCK: ACT_PRINTHEAD1.11(SCK) DA_PRINTHEAD1.11(SCK) DC_PRINTHEAD1.11(SCK) DG_PRINTHEAD1.11(SCK) DT_PRINTHEAD1.11(SCK) U7.5(47)
RX: MEGA-D1.8(0)
SCL: H9.6(A5) MEGA-D2.8(21)
SDA: H9.5(A4) MEGA-D2.7(20)
TX: MEGA-D1.7(1)
valve: MEGA-SCL2.5(13) R6.2
wash_E: MEGA-SCL2.9
wash_enable: WASH_R1.8
wash_pulse: MEGA-D1.5(3)
wash_step: WASH_R1.2
waste_E: MEGA-SCL2.6(12)
waste_enable: WASTE1_R.8 WASTE2_R.8
waste_pulse: MEGA-D1.2(6)
waste_RX: MEGA-D2.2(15)
waste_step: WASTE1_R.2 WASTE2_R.2
waste_TX: MEGA-D2.1(14)
Net-(12V_POWER-1): 12V_POWER.1(12V) D4.2(A)
Net-(ACT_L1-3): ACT_L1.3(B1) ACT_M1.4
Net-(ACT_L1-4): ACT_L1.4(A1) ACT_M1.3
Net-(ACT_L1-5): ACT_L1.5(A2) ACT_M1.2
Net-(ACT_L1-6): ACT_L1.6(B2) ACT_M1.1
Net-(ACT_PH_C1-1): ACT_PH_C1.1 ACT_PH_C2.1 ACT_PH_C3.2 ACT_PH_C4.2 ACT_PH_D1.1(K) ACT_PH_M1.3(S) ACT_PH_R1.1 ACT_PH_ZD1.1
Net-(ACT_PH_C5-1): ACT_PH_C5.1 ACT_PH_D2.1(K) ACT_PH_M2.3(S) ACT_PH_R3.1 ACT_PH_ZD2.1
Net-(ACT_PH_M1-1): ACT_PH_M1.1(G) ACT_PH_R1.2 ACT_PH_T1.1(C) ACT_PH_ZD1.2
Net-(ACT_PH_M2-1): ACT_PH_M2.1(G) ACT_PH_R3.2 ACT_PH_T2.1(C) ACT_PH_ZD2.2
Net-(ACT_PH_R2-2): ACT_PH_R2.2 ACT_PH_T1.3(E)
Net-(ACT_PH_R4-2): ACT_PH_R4.2 ACT_PH_T2.3(E)
Net-(ACT_R1-3): ACT_R1.3 ACT_R1.4
Net-(ACT_R1-5): ACT_R1.5 H5.1
Net-(ACT_R1-6): ACT_R1.6 H5.3
Net-(ACT_R1-7): ACT_R1.7 H5.5
Net-(ACT_S1-3): ACT_S1.3(S) ACT_S_R1.1
Net-(D2-2): D2.2 Q2.2(C) U6.2(GND)
Net-(D5-2): D5.2(A) MOTOR_POWER1.1(24V)
Net-(DA_L1-3): DA_L1.3 DA_M1.4
Net-(DA_L1-4): DA_L1.4 DA_M1.3
Net-(DA_L1-5): DA_L1.5 DA_M1.2
Net-(DA_L1-6): DA_L1.6 DA_M1.1
Net-(DA_PH_C1-1): DA_PH_C1.1 DA_PH_C2.1 DA_PH_C3.2 DA_PH_C4.2 DA_PH_D1.1(K) DA_PH_M1.3(S) DA_PH_R1.1 DA_PH_ZD1.1
Net-(DA_PH_C5-1): DA_PH_C5.1 DA_PH_D2.1(K) DA_PH_M2.3(S) DA_PH_R3.1 DA_PH_ZD2.1
Net-(DA_PH_M1-1): DA_PH_M1.1(G) DA_PH_R1.2 DA_PH_T1.1(C) DA_PH_ZD1.2
Net-(DA_PH_M2-1): DA_PH_M2.1(G) DA_PH_R3.2 DA_PH_T2.1(C) DA_PH_ZD2.2
Net-(DA_PH_R2-2): DA_PH_R2.2 DA_PH_T1.3(E)
Net-(DA_PH_R4-2): DA_PH_R4.2 DA_PH_T2.3(E)
Net-(DA_R1-3): DA_R1.3 DA_R1.4
Net-(DA_R1-5): DA_R1.5 H1.1
Net-(DA_R1-6): DA_R1.6 H1.3
Net-(DA_R1-7): DA_R1.7 H1.5
Net-(DA_S1-3): DA_S1.3(S) DA_S_R1.1
Net-(DC_L1-3): DC_L1.3 DC_M1.4
Net-(DC_L1-4): DC_L1.4 DC_M1.3
Net-(DC_L1-5): DC_L1.5 DC_M1.2
Net-(DC_L1-6): DC_L1.6 DC_M1.1
Net-(DC_PH_C2-1): DC_PH_C2.1 DC_PH_C3.2 DC_PH_C4.2 DC_PH_C7.1 DC_PH_D1.1(K) DC_PH_M1.3(S) DC_PH_R1.1 DC_PH_ZD1.1
Net-(DC_PH_C5-1): DC_PH_C5.1 DC_PH_D2.1(K) DC_PH_M2.3(S) DC_PH_R3.1 DC_PH_ZD2.1
Net-(DC_PH_M1-1): DC_PH_M1.1(G) DC_PH_R1.2 DC_PH_T1.1(C) DC_PH_ZD1.2
Net-(DC_PH_M2-1): DC_PH_M2.1(G) DC_PH_R3.2 DC_PH_T2.1(C) DC_PH_ZD2.2
Net-(DC_PH_R2-2): DC_PH_R2.2 DC_PH_T1.3(E)
Net-(DC_PH_R4-2): DC_PH_R4.2 DC_PH_T2.3(E)
Net-(DC_R1-3): DC_R1.3 DC_R1.4
Net-(DC_R1-5): DC_R1.5 H4.1
Net-(DC_R1-6): DC_R1.6 H4.3
Net-(DC_R1-7): DC_R1.7 H4.5
Net-(DC_S1-3): DC_S1.3(S) DC_S_R1.1
Net-(DET_L1-3): DET_L1.3 DET_M1.4
Net-(DET_L1-4): DET_L1.4 DET_M1.3
Net-(DET_L1-5): DET_L1.5 DET_M1.2
Net-(DET_L1-6): DET_L1.6 DET_M1.1
Net-(DET_R1-3): DET_R1.3 DET_R1.4
Net-(DET_R1-5): DET_R1.5 H18.1
Net-(DET_R1-6): DET_R1.6 H18.3
Net-(DET_R1-7): DET_R1.7 H18.5
Net-(DG_L1-3): DG_L1.3 DG_M2.4
Net-(DG_L1-4): DG_L1.4 DG_M2.3
Net-(DG_L1-5): DG_L1.5 DG_M2.2
Net-(DG_L1-6): DG_L1.6 DG_M2.1
Net-(DG_PH_C1-1): DG_PH_C1.1 DG_PH_C2.1 DG_PH_C3.2 DG_PH_C4.2 DG_PH_D1.1(K) DG_PH_M1.3(S) DG_PH_R1.1 DG_PH_ZD1.1
Net-(DG_PH_C5-1): DG_PH_C5.1 DG_PH_D2.1(K) DG_PH_M2.3(S) DG_PH_R3.1 DG_PH_ZD2.1
Net-(DG_PH_M1-1): DG_PH_M1.1(G) DG_PH_R1.2 DG_PH_T1.1(C) DG_PH_ZD1.2
Net-(DG_PH_M2-1): DG_PH_M2.1(G) DG_PH_R3.2 DG_PH_T2.1(C) DG_PH_ZD2.2
Net-(DG_PH_R2-2): DG_PH_R2.2 DG_PH_T1.3(E)
Net-(DG_PH_R4-2): DG_PH_R4.2 DG_PH_T2.3(E)
Net-(DG_R1-3): DG_R1.3 DG_R1.4
Net-(DG_R1-5): DG_R1.5 H3.1
Net-(DG_R1-6): DG_R1.6 H3.3
Net-(DG_R1-7): DG_R1.7 H3.5
Net-(DG_S1-3): DG_S1.3(S) DG_S_R1.1
Net-(DT_L1-3): DT_L1.3 DT_M2.4
Net-(DT_L1-4): DT_L1.4 DT_M2.3
Net-(DT_L1-5): DT_L1.5 DT_M2.2
Net-(DT_L1-6): DT_L1.6 DT_M2.1
Net-(DT_PH_C1-1): DT_PH_C1.1 DT_PH_C2.1 DT_PH_C3.2 DT_PH_C4.2 DT_PH_D1.1(K) DT_PH_M1.3(S) DT_PH_R1.1 DT_PH_ZD1.1
Net-(DT_PH_C5-1): DT_PH_C5.1 DT_PH_D2.1(K) DT_PH_M2.3(S) DT_PH_R3.1 DT_PH_ZD2.1
Net-(DT_PH_M1-1): DT_PH_M1.1(G) DT_PH_R1.2 DT_PH_T1.1(C) DT_PH_ZD1.2
Net-(DT_PH_M2-1): DT_PH_M2.1(G) DT_PH_R3.2 DT_PH_T2.1(C) DT_PH_ZD2.2
Net-(DT_PH_R2-2): DT_PH_R2.2 DT_PH_T1.3(E)
Net-(DT_PH_R4-2): DT_PH_R4.2 DT_PH_T2.3(E)
Net-(DT_R1-3): DT_R1.3 DT_R1.4
Net-(DT_R1-5): DT_R1.5 H2.1
Net-(DT_R1-6): DT_R1.6 H2.3
Net-(DT_R1-7): DT_R1.7 H2.5
Net-(DT_S1-3): DT_S1.3(S) DT_S_R1.1
Net-(H8-3): H8.3(RESET) SW1.1
Net-(H8-5): H8.5(5V) R2.1 SW1.3
Net-(H14-1): H14.1 WASH_R1.5
Net-(H14-3): H14.3 WASH_R1.6
Net-(H14-5): H14.5 WASH_R1.7
Net-(H15-1): H15.1 WASTE2_R.5
Net-(H15-3): H15.3 WASTE2_R.6
Net-(H15-5): H15.5 WASTE2_R.7
Net-(H16-1): H16.1 WASTE1_R.5
Net-(H16-3): H16.3 WASTE1_R.6
Net-(H16-5): H16.5 WASTE1_R.7
Net-(H17-1): H17.1 OXI_R1.5
Net-(H17-3): H17.3 OXI_R1.6
Net-(H17-5): H17.5 OXI_R1.7
Net-(H19-1): H19.1 LINEAR_R1.5
Net-(H19-3): H19.3 LINEAR_R1.6
Net-(H19-5): H19.5 LINEAR_R1.7
Net-(LINEAR_L1-3): LINEAR_L1.3 LINEAR_M1.4
Net-(LINEAR_L1-4): LINEAR_L1.4 LINEAR_M1.3
Net-(LINEAR_L1-5): LINEAR_L1.5 LINEAR_M1.2
Net-(LINEAR_L1-6): LINEAR_L1.6 LINEAR_M1.1
Net-(LINEAR_R1-3): LINEAR_R1.3 LINEAR_R1.4
Net-(MEGA-IOREF1-3): MEGA-IOREF1.3(RESET) SW3.4
Net-(MEGA-IOREF1-5): MEGA-IOREF1.5(5V) SW3.2
Net-(OXI_L1-3): OXI_L1.3 OXI_M1.4
Net-(OXI_L1-4): OXI_L1.4 OXI_M1.3
Net-(OXI_L1-5): OXI_L1.5 OXI_M1.2
Net-(OXI_L1-6): OXI_L1.6 OXI_M1.1
Net-(OXI_R1-3): OXI_R1.3 OXI_R1.4
Net-(Q2-1): Q2.1(B) R6.1
Net-(R1-2): R1.2 U5.1(none)
Net-(WASH_L1-3): WASH_L1.3(B1) WASH_M1.4
Net-(WASH_L1-4): WASH_L1.4(A1) WASH_M1.3
Net-(WASH_L1-5): WASH_L1.5(A2) WASH_M1.2
Net-(WASH_L1-6): WASH_L1.6(B2) WASH_M1.1
Net-(WASH_R1-3): WASH_R1.3 WASH_R1.4
Net-(WASTE1_L-3): WASTE1_L.3 WASTE1_M.4
Net-(WASTE1_L-4): WASTE1_L.4 WASTE1_M.3
Net-(WASTE1_L-5): WASTE1_L.5 WASTE1_M.2
Net-(WASTE1_L-6): WASTE1_L.6 WASTE1_M.1
Net-(WASTE1_R-3): WASTE1_R.3 WASTE1_R.4
Net-(WASTE2_L-3): WASTE2_L.3 WASTE2_M.4
Net-(WASTE2_L-4): WASTE2_L.4 WASTE2_M.3
Net-(WASTE2_L-5): WASTE2_L.5 WASTE2_M.2
Net-(WASTE2_L-6): WASTE2_L.6 WASTE2_M.1
Net-(WASTE2_R-3): WASTE2_R.3 WASTE2_R.4

Not connected (* = marked no-connect by the designer): H6 1(SCL) 2(SDA) 3(AREF) 5(13) 6(12); H8 1 2(IOREF) 4(3.3V); MEGA-A1 3(A2) 4(A3) 5(A4) 6(A5) 7(A6) 8(A7); MEGA-A2 1(A8) 2(A9) 3(A10) 4(A11) 5(A12) 6(A13) 7(A14) 8(A15); MEGA-IOREF1 1 2(IOREF) 4(3.3V); MEGA-SCL2 1(SCL) 2(SDA) 3(AREF); SW1 2 4; SW3 1 3; U7 2(53) 18(none)

## Notes on the sheet
- bulk solution pumps
- pressure control pumps
- Arduino Mega
- XAAR irix printheads
- Arduino Uno
- IDC커넥터
  1:nSS2   2:GNDH
  3:VPPH   4:VPPL
  5:GNDL   6:FAULT
  7:RESET   8:MOSI
  9:VDD   10:GND
  11:SCK   12:nSS1
  13:MISO  14:READY
  15:CLK   16:FIRE
- dC_S
- Air pressure sensors
- solenoid valve
- linear stage limit sensors
- Powers
- power for printheads
